# EAGLE design TeensyPCB (EAGLE 6.4)
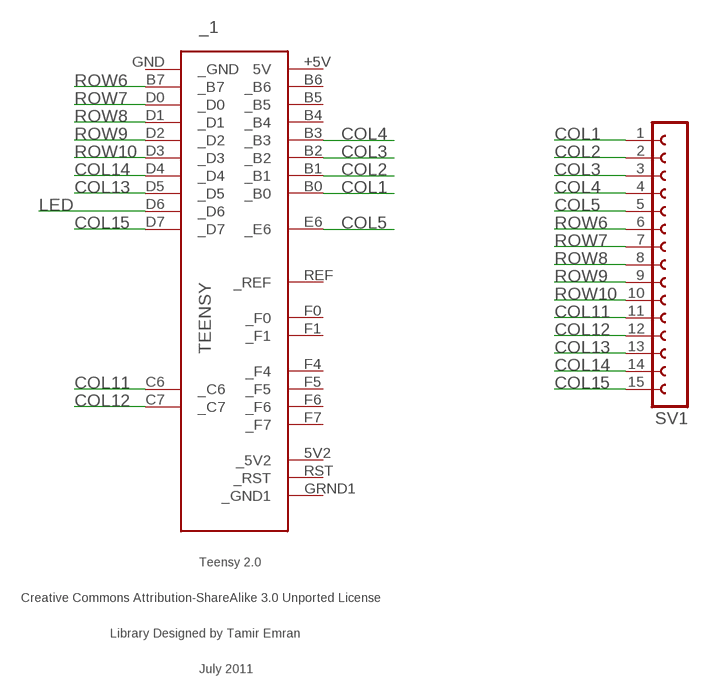
[diagram p0: schematic, sheet 1]

## Parts
_1  TEENSY  [TEENSY]
SV1  FE15-1  [FE15]

## Nets
COL1: _1.B0(_B0) SV1.1
COL2: _1.B1(_B1) SV1.2
COL3: _1.B2(_B2) SV1.3
COL4: _1.B3(_B3) SV1.4
COL5: _1.E6(_E6) SV1.5
COL11: _1.C6(_C6) SV1.11
COL12: _1.C7(_C7) SV1.12
COL13: _1.D5(_D5) SV1.13
COL14: _1.D4(_D4) SV1.14
COL15: _1.D7(_D7) SV1.15
LED: _1.D6(_D6)
ROW6: _1.B7(_B7) SV1.6
ROW7: _1.D0(_D0) SV1.7
ROW8: _1.D1(_D1) SV1.8
ROW9: _1.D2(_D2) SV1.9
ROW10: _1.D3(_D3) SV1.10
Unconnected: _1.5V2(_5V2) _1.+5V(5V) _1.B4(_B4) _1.B5(_B5) _1.B6(_B6) _1.F0(_F0) _1.F1(_F1) _1.F4(_F4) _1.F5(_F5) _1.F6(_F6) _1.F7(_F7) _1.GND(_GND) _1.GRND1(_GND1) _1.REF(_REF) _1.RST(_RST)

## Library data of the parts
_1 = teensy:TEENSY: Teensy 2.0 Original Design by Clint Fisher Modified Design by Tamir Emran Licensed Under Creative Commons Attribution-ShareAlike 3.0 Unported (CC BY-SA 3.0)
SV1 = con-lsta:FE15-1: FEMALE HEADER; OC_FARNELL: unknown; OC_NEWARK: unknown

## Board
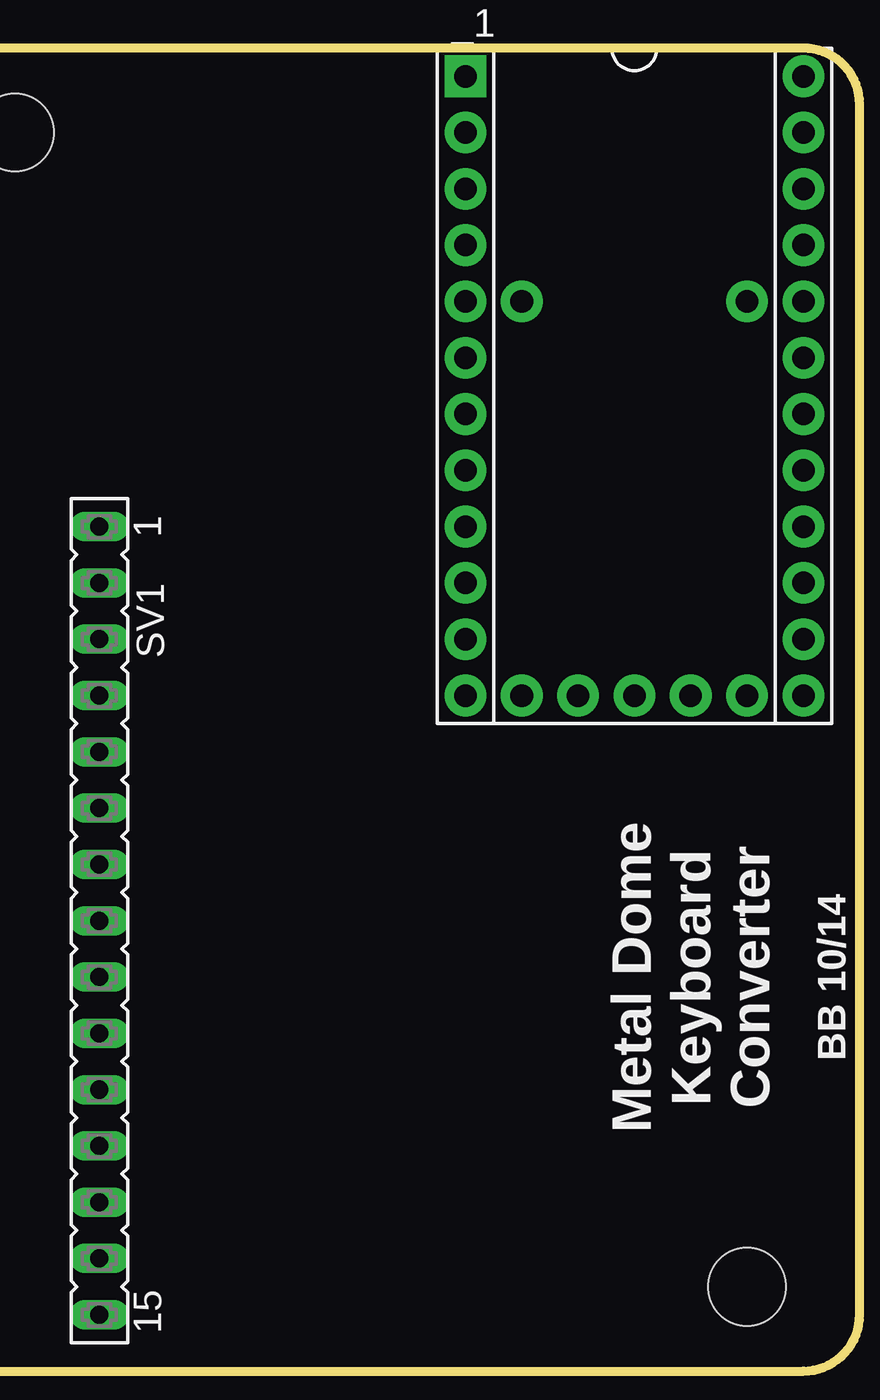
[diagram p1: board, top side]
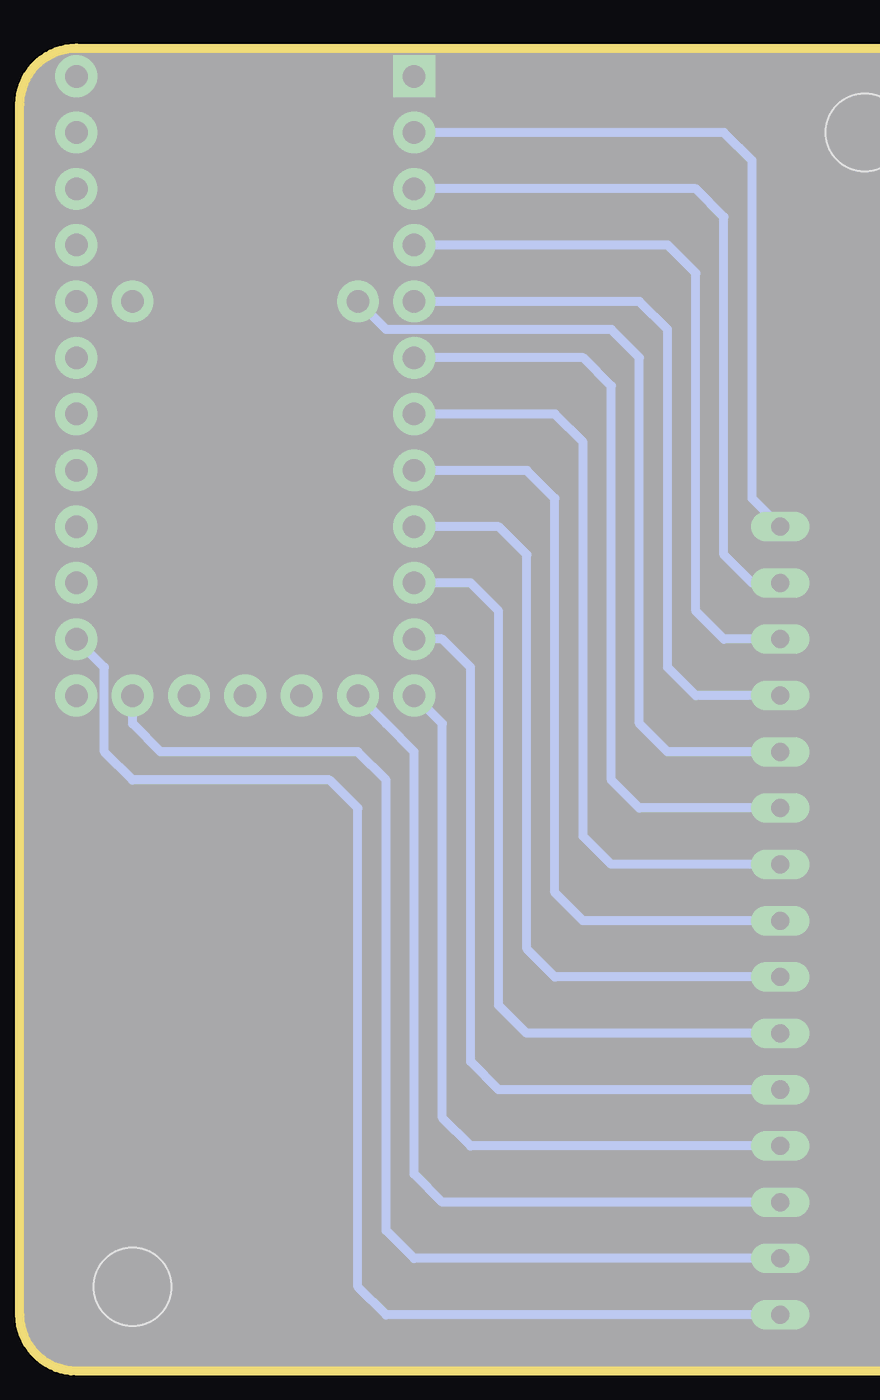
[diagram p2: board, bottom side, seen from below]

No outline drawn. Coordinates in mm, seen from the top.
Copper layers (1*16): Top 0.035mm / dielectric 1.5mm / Bottom 0.035mm
Design rules "default": minimum track width 10mil, minimum drill 24mil, track to track 8mil, track to pad 8mil, pad to pad 8mil, via to via 8mil, smd to smd 8mil, copper to edge 40mil, drill to drill 8mil, minimum pad ring 10mil, minimum via ring 8mil, stop-mask expansion 4mil, vias tented up to drill 0mil, thermal gap 10mil
Holes 3.5 mm at 16.51,59.69 49.53,7.62
Milling: 8 lines

### Footprints (pad centres in the part's own frame; a part is rotated, then mirrored left to right if it is on the bottom)
TEENSY = drill 1.016 pad 1.88: 5V2 13.97,-2.54; +5V -13.97,7.62; B0 -11.43,-7.62; B1 -8.89,-7.62; B2 -6.35,-7.62; B3 -3.81,-7.62; B4 8.89,7.62; B5 6.35,7.62; B6 3.81,7.62; B7 -1.27,-7.62; C6 11.43,-7.62; C7 13.97,-7.62; D0 1.27,-7.62; D1 3.81,-7.62; D2 6.35,-7.62; D3 8.89,-7.62; D4 13.97,5.08; D5 13.97,-5.08; D6 13.97,7.62; D7 11.43,7.62; E6 -3.81,-5.08; F0 -11.43,7.62; F1 -8.89,7.62; F4 -6.35,7.62; F5 -3.81,7.62; F6 -1.27,7.62; F7 1.27,7.62; GRND1 13.97,0; REF -3.81,5.08; RST 13.97,2.54 | drill 1.016 pad 1.88 square: GND -13.97,-7.62
FE15 = drill 0.813 long: 1 -17.78,0; 2 -15.24,0; 3 -12.7,0; 4 -10.16,0; 5 -7.62,0; 6 -5.08,0; 7 -2.54,0; 8 0,0; 9 2.54,0; 10 5.08,0; 11 7.62,0; 12 10.16,0; 13 12.7,0; 14 15.24,0; 15 17.78,0

### Placement (x,y rotation side)
_1  44.45,48.26 270 top
SV1  20.32,24.13 270 top

### Tracks (layer width: path | path; a pad name or v marks a point on that pad's centre or on a via)
COL1
  Bottom 0.406: SV1.1 21.59,43.18 21.59,58.42 22.86,59.69 _1.B0
COL2
  Bottom 0.406: SV1.2 21.59,39.37 22.86,40.64 22.86,55.88 24.13,57.15 _1.B1
COL3
  Bottom 0.406: SV1.3 22.86,36.83 24.13,38.1 24.13,53.34 25.4,54.61 _1.B2
COL4
  Bottom 0.406: SV1.4 24.13,34.29 25.4,35.56 25.4,50.8 26.67,52.07 _1.B3
COL5
  Bottom 0.406: SV1.5 25.4,31.75 26.67,33.02 26.67,49.53 27.3,50.16 27.94,50.8 38.1,50.8 _1.E6
COL11
  Bottom 0.406: SV1.11 33.02,16.51 34.29,17.78 34.29,35.56 35.56,36.83 _1.C6
COL12
  Bottom 0.406: SV1.12 34.29,13.97 35.56,15.24 35.56,33.02 _1.C7
COL13
  Bottom 0.406: SV1.13 35.56,11.43 36.83,12.7 36.83,31.75 38.1,33.02 _1.D5
COL14
  Bottom 0.406: SV1.14 36.83,8.89 38.1,10.16 38.1,30.48 39.37,31.75 48.26,31.75 49.53,33.02 _1.D4
COL15
  Bottom 0.406: SV1.15 38.1,6.35 39.37,7.62 39.37,29.21 40.64,30.48 49.53,30.48 50.8,31.75 50.8,35.56 _1.D7
ROW6
  Bottom 0.406: SV1.6 26.67,29.21 27.94,30.48 27.94,48.26 29.21,49.53 _1.B7
ROW7
  Bottom 0.406: SV1.7 27.94,26.67 29.21,27.94 29.21,45.72 30.48,46.99 _1.D0
ROW8
  Bottom 0.406: SV1.8 29.21,24.13 30.48,25.4 30.48,43.18 31.75,44.45 _1.D1
ROW9
  Bottom 0.406: SV1.9 30.48,21.59 31.75,22.86 31.75,40.64 33.02,41.91 _1.D2
ROW10
  Bottom 0.406: SV1.10 31.75,19.05 33.02,20.32 33.02,38.1 34.29,39.37 _1.D3

### Text on the board
tPlace: Metal Dome / Keyboard / Converter | BB 10/14